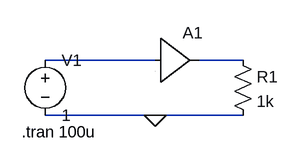
[diagram p0: schematic Draft1.asc]
Draft1.asc, the LTspice schematic file:
Version 4
SHEET 1 880 680
WIRE 256 240 96 240
WIRE 384 240 320 240
WIRE 256 320 96 320
WIRE 384 320 256 320
FLAG 256 320 0
SYMBOL Digital\\buf1 256 176 R0
SYMATTR InstName A1
SYMBOL voltage 96 224 R0
WINDOW 123 0 0 Left 0
WINDOW 39 0 0 Left 0
SYMATTR InstName V1
SYMATTR Value 1
SYMBOL res 368 224 R0
SYMATTR InstName R1
SYMATTR Value 1k
TEXT 62 344 Left 2 !.tran 100u

The netlist it stands for:
* Draft1.asc
A1 N001 0 0 0 0 0 N002 0 BUF
V1 N001 0 1
R1 N002 0 1k
.tran 100u
.backanno
.end